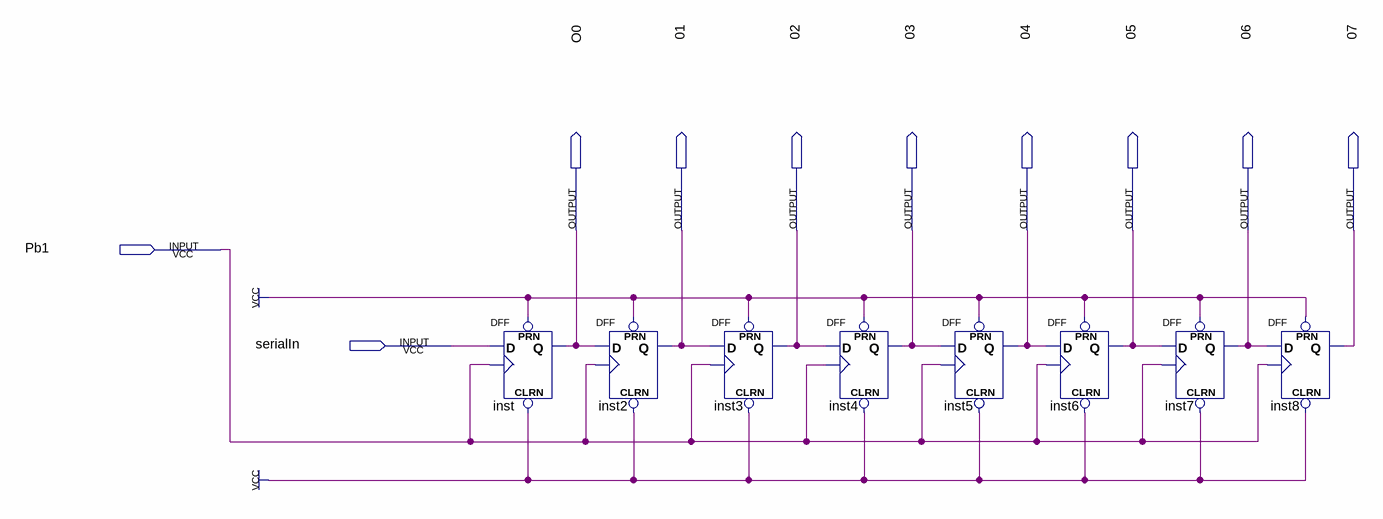
[diagram p0: schematic sheet]
// Quartus schematic sipo.bdf as structural Verilog: 8 symbols, 10 pins
module sipo (
  input  Pb1,
  input  serialIn,
  output O0,
  output \01 ,
  output \02 ,
  output \03 ,
  output \04 ,
  output \05 ,
  output \06 ,
  output \07 
);

  DFF inst (.CLRN(1'b1), .CLK(Pb1), .D(serialIn), .PRN(1'b1), .Q(O0));
  DFF inst2 (.CLRN(1'b1), .CLK(Pb1), .D(O0), .PRN(1'b1), .Q(\01 ));
  DFF inst3 (.CLRN(1'b1), .CLK(Pb1), .D(\01 ), .PRN(1'b1), .Q(\02 ));
  DFF inst4 (.CLRN(1'b1), .CLK(Pb1), .D(\02 ), .PRN(1'b1), .Q(\03 ));
  DFF inst5 (.CLRN(1'b1), .CLK(Pb1), .D(\03 ), .PRN(1'b1), .Q(\04 ));
  DFF inst6 (.CLRN(1'b1), .CLK(Pb1), .D(\04 ), .PRN(1'b1), .Q(\05 ));
  DFF inst7 (.CLRN(1'b1), .CLK(Pb1), .D(\05 ), .PRN(1'b1), .Q(\06 ));
  DFF inst8 (.CLRN(1'b1), .CLK(Pb1), .D(\06 ), .PRN(1'b1), .Q(\07 ));
endmodule
